# Altium schematic sheet U2S_TOP.SchDoc
size A
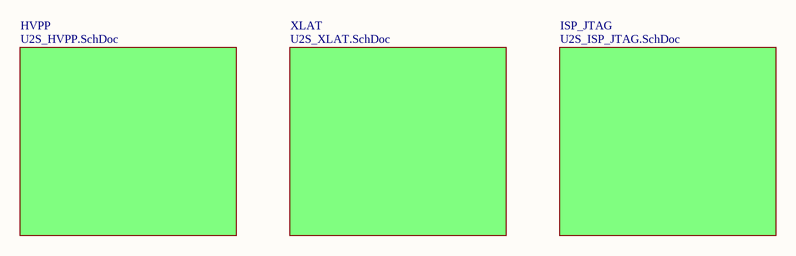
[diagram p0: U2S_TOP.SchDoc]

## Sub-sheets
HVPP = U2S_HVPP.SchDoc: no entries
ISP_JTAG = U2S_ISP_JTAG.SchDoc: no entries
XLAT = U2S_XLAT.SchDoc: no entries